# EAGLE design sensor_board_v0.8 (EAGLE 7.6.0)
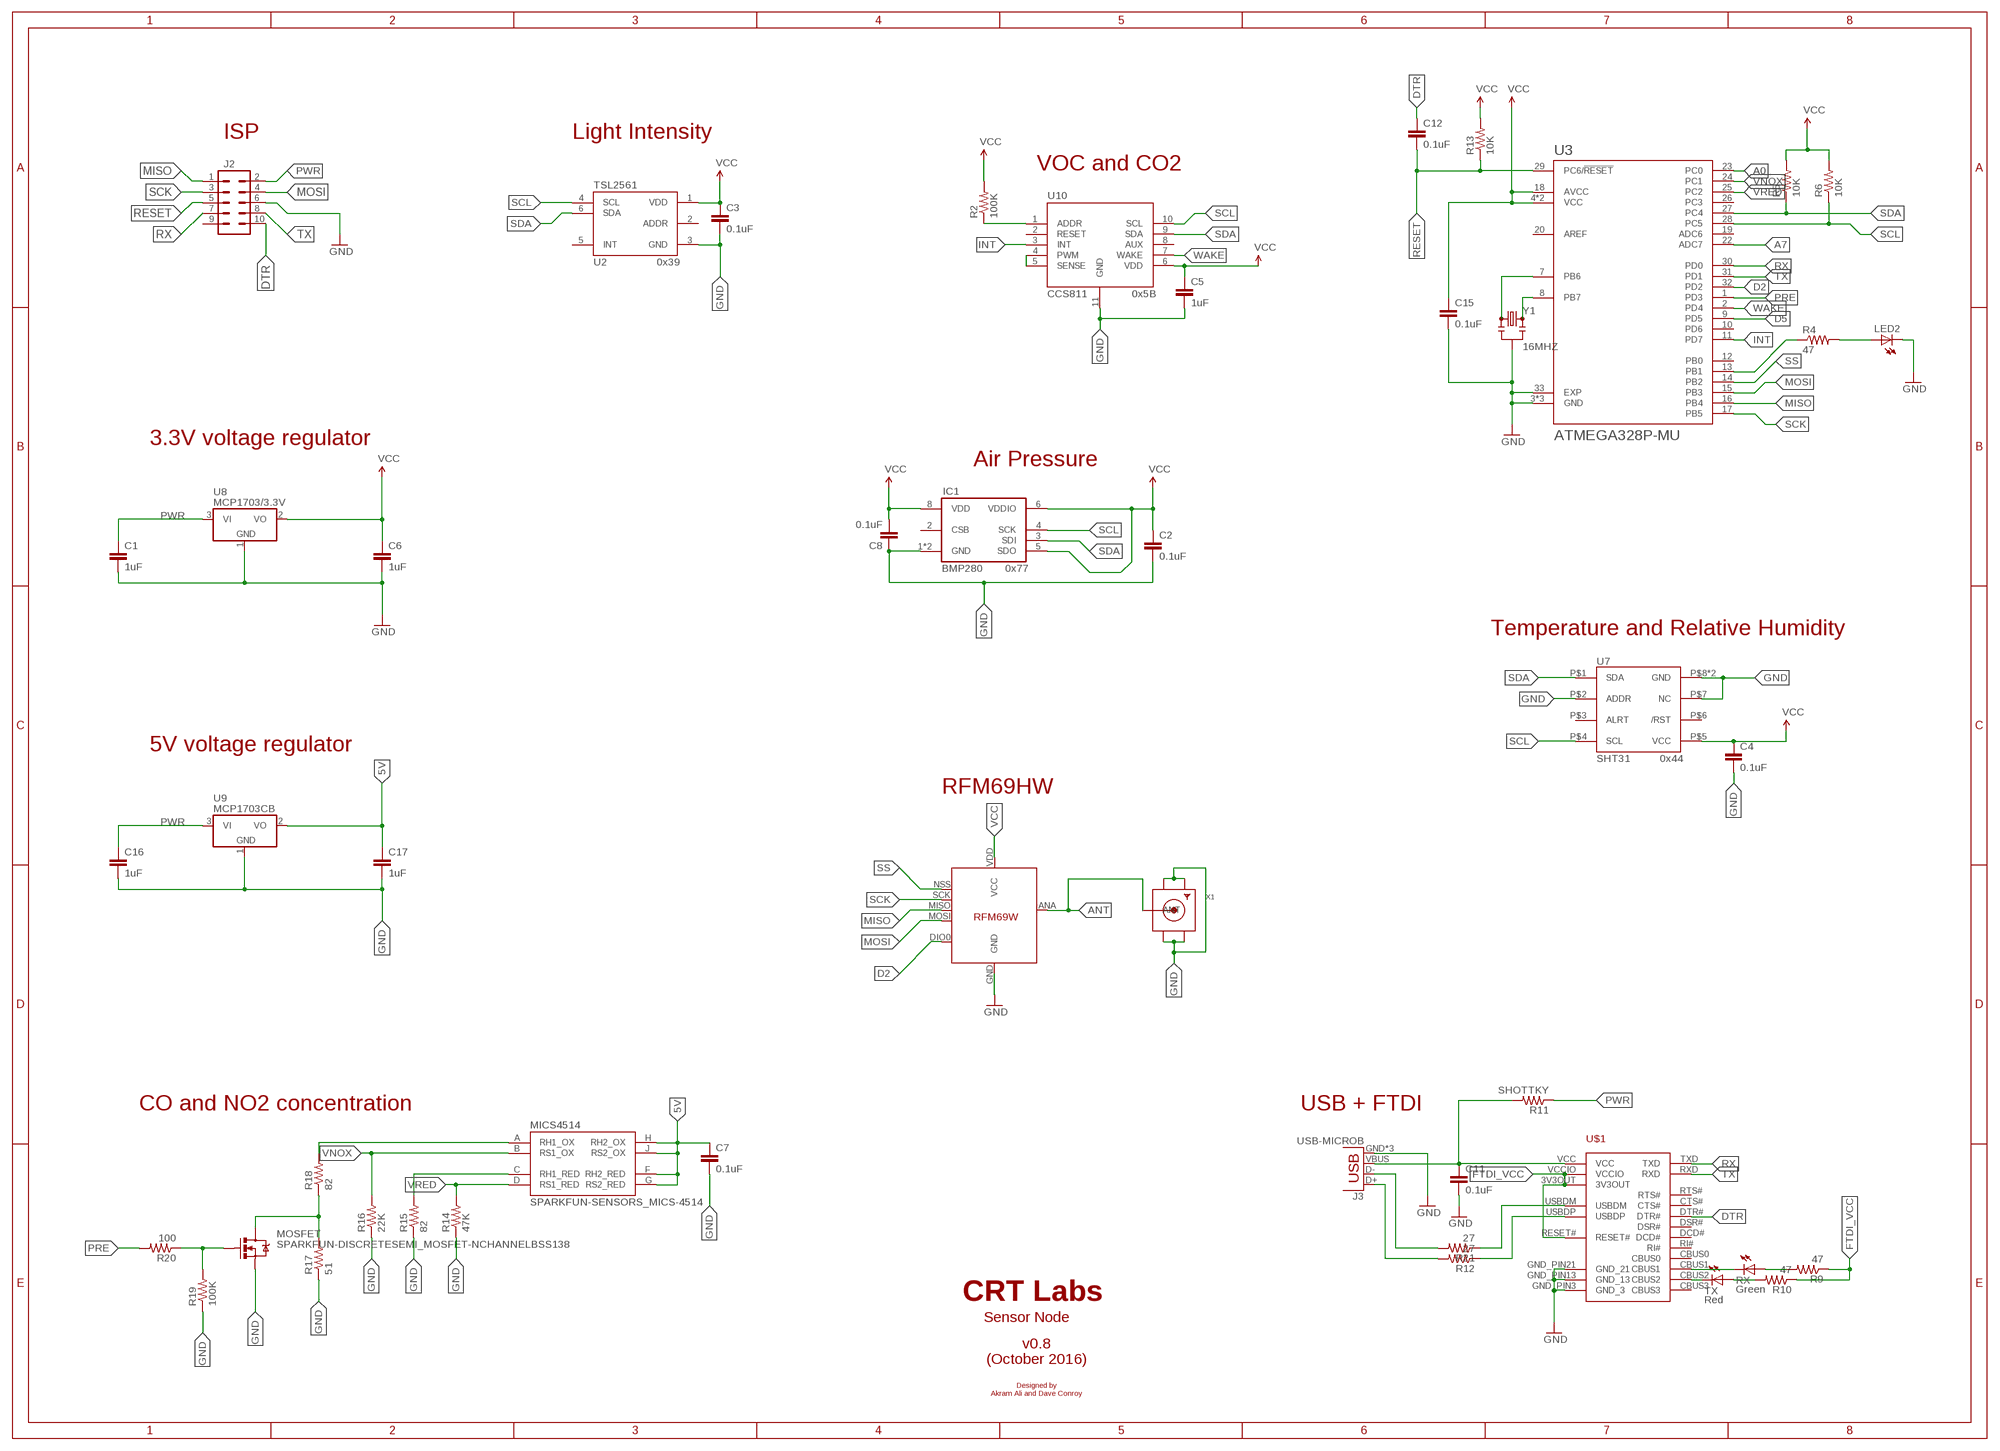
[diagram p0: schematic, sheet 1]

## Parts
C1  1uF  CAP0805  [0805]
C2  0.1uF  CAP0805  [0805]
C3  0.1uF  CAP0805  [0805]
C4  0.1uF  CAP0805  [0805]
C5  1uF  CAP0805  [0805]
C6  1uF  CAP0805  [0805]
C7  0.1uF  CAP0805  [0805]
C8  0.1uF  CAP0805  [0805]
C11  0.1uF  CAP0805  [0805]
C12  0.1uF  CAP0805  [0805]
C15  0.1uF  CAP0805  [0805]
C16  1uF  CAP0805  [0805]
C17  1uF  CAP0805  [0805]
IC1  BMP280  [BMP280]
J2  M05X2PTH  [AVR_ICSP]
J3  USB-MICROB  [USB-MICROB]
LED2  LEDCHIPLED_0805  [CHIPLED_0805]
MICS4514  SPARKFUN-SENSORS_MICS-4514  [SPARKFUN-SENSORS_MICS_10-SMD]
MOSFET  SPARKFUN-DISCRETESEMI_MOSFET-NCHANNELBSS138  [SPARKFUN-DISCRETESEMI_SOT23-3]
R2  100K  RESISTOR0805-RES  [0805]
R4  47  RESISTOR0805-RES  [0805]
R5  10K  RESISTOR0805-RES  [0805]
R6  10K  RESISTOR0805-RES  [0805]
R9  47  RESISTOR0805-RES  [0805]
R10  47  RESISTOR0805-RES  [0805]
R11  SHOTTKY  RESISTOR0805-RES  [0805]
R12  27  RESISTOR0805-RES  [0805]
R13  10K  RESISTOR0805-RES  [0805]
R14  47K  RESISTOR0805-RES  [0805]
R15  82  RESISTOR0805-RES  [0805]
R16  22K  RESISTOR0805-RES  [0805]
R17  51  RESISTOR0805-RES  [0805]
R18  82  RESISTOR0805-RES  [0805]
R19  100K  RESISTOR0805-RES  [0805]
R20  100  RESISTOR0805-RES  [0805]
R21  27  RESISTOR0805-RES  [0805]
RX  Green  LEDCHIPLED_0805  [CHIPLED_0805]
TX  Red  LEDCHIPLED_0805  [CHIPLED_0805]
U2  TSL2561  TSL2561FN  [FN-6]
U3  ATMEGA328P-MU  [QFN50P500X500X100-33N]
U7  SHT31  SHT31-DIS  [SHT3X]
U8  MCP1703/3.3V  MCP1703CB  [SOT23]
U9  MCP1703CB  [SOT23]
U10  CCS811  CCS811-I2C  [LGA]
U11  RFM69HW  LOWPOWERLAB_RFM69  [LOWPOWERLAB_RFM69W-MINPADS]
U$1  FT231XQ-R  [FTDI_FT231XQ-R_PACKAGE]
X1  SMACONNECTOR_EDGE  [SMA_EDGELAUNCH]
Y1  16MHZ  RESONATOR16MHZ  [RESONATOR-SMD]

## Nets
5V: C7.1 C17.1 MICS4514.F(RH2_RED) MICS4514.G(RS2_RED) MICS4514.H(RH2_OX) MICS4514.J(RS2_OX) U9.2(VO)
A0: U3.23(PC0)
A7: U3.22(ADC7)
ANT: U11.ANA(ANT) X1.P(ANT)
D2: U3.32(PD2) U11.DIO0
D5: U3.9(PD5)
DTR: C12.1 J2.10 U$1.DTR#
FTDI_VCC: R9.1 R10.1 U$1.3V3OUT U$1.RESET# U$1.VCCIO
GND: C1.2 C2.2 C3.2 C4.2 C5.2 C6.2 C7.2 C8.1 C11.2 C15.2 C16.2 C17.2 IC1.1(GND) IC1.7(GND) J2.6 J3.GND J3.MT1(GND) J3.MT2(GND) LED2.C MOSFET.2(S) R14.1 R15.1 R16.1 R17.1 R19.1 U2.3(GND) U3.3(GND) U3.5(GND) U3.21(GND) U3.33(EXP) U7.P$2(ADDR) U7.P$7(NC) U7.P$8(GND) U7.PAD(GND) U8.1(GND) U9.1(GND) U10.11(GND) U11.GND U$1.GND_PIN3(GND_3) U$1.GND_PIN13(GND_13) U$1.GND_PIN21(GND_21) X1.GND@1(GND4) X1.GND@2(GND3) X1.GND@3(GND2) X1.GND@4(GND1) Y1.2
INT: U3.11(PD7) U10.3(INT)
MISO: J2.1 U3.16(PB4) U11.MISO
MOSI: J2.4 U3.15(PB3) U11.MOSI
N$1: R2.1 U10.1(ADDR)
N$2: R4.1 U3.13(PB1)
N$3: LED2.A R4.2
N$4: U3.8(PB7) Y1.3
N$5: U3.7(PB6) Y1.1
N$6: U10.4(PWM) U10.5(SENSE)
N$8: MICS4514.A(RH1_OX) R18.2
N$13: MICS4514.C(RH1_RED) R15.2
N$17: RX.C U$1.CBUS1
N$18: TX.C U$1.CBUS2
N$20: MOSFET.3(D) R17.2 R18.1
N$23: MOSFET.1(G) R19.2 R20.1
N$25: R21.1 U$1.USBDM
N$26: R12.1 U$1.USBDP
N$27: R9.2 RX.A
N$29: R10.2 TX.A
N$32: J3.D- R21.2
N$33: J3.D+ R12.2
PRE: R20.2 U3.1(PD3)
PWR: C1.1 C16.1 J2.2 R11.1 U8.3(VI) U9.3(VI)
RESET: C12.2 J2.5 R13.1 U3.29(PC6/!RESET)
RX: J2.7 U3.30(PD0) U$1.TXD
SCK: J2.3 U3.17(PB5) U11.SCK
SCL: IC1.4(SCK) R6.1 U2.4(SCL) U3.28(PC5) U7.P$4(SCL) U10.10(SCL)
SDA: IC1.3(SDI) R5.1 U2.6(SDA) U3.27(PC4) U7.P$1(SDA) U10.9(SDA)
SS: U3.14(PB2) U11.NSS(SEL)
TX: J2.8 U3.31(PD1) U$1.RXD
VBUS: C11.1 J3.VBUS R11.2 U$1.VCC
VCC: C2.1 C3.1 C4.1 C5.1 C6.1 C8.2 C15.1 IC1.5(SDO) IC1.6(VDDIO) IC1.8(VDD) R2.2 R5.2 R6.2 R13.2 U2.1(VDD) U3.4(VCC) U3.6(VCC) U3.18(AVCC) U7.P$5(VCC) U8.2(VO) U10.6(VDD) U11.VDD(VCC)
VNOX: MICS4514.B(RS1_OX) R16.2 U3.24(PC1)
VRED: MICS4514.D(RS1_RED) R14.2 U3.25(PC2)
WAKE: U3.2(PD4) U10.7(WAKE)
Unconnected: IC1.2(CSB) J2.9 U2.2(ADDR) U2.5(INT) U3.10(PD6) U3.12(PB0) U3.19(ADC6) U3.20(AREF) U3.26(PC3) U7.P$3(ALRT) U7.P$6(/RST) U10.2(RESET) U10.8(AUX) U$1.CBUS0 U$1.CBUS3 U$1.CTS# U$1.DCD# U$1.DSR# U$1.RI# U$1.RTS#

## Notes on the sheet
- ISP | Light Intensity
- VOC and CO2
- 0x39
- 0x5B
- 3.3V voltage regulator
- Air Pressure
- 0x77
- Temperature and Relative Humidity
- 5V voltage regulator
- 0x44
- RFM69HW
- CO and NO2 concentration | USB + FTDI
- CRT Labs
- Sensor Node
- v0.8
  (October 2016)
- Designed by
  Akram Ali and Dave Conroy

## Library data of the parts
C1 C6 C11 C16 C17 = SparkFun-Capacitors:CAP: Capacitor Standard 0603 ceramic capacitor, and 0.1" leaded capacitor.; OC_NEWARK: unknown
C2 C8 C12 C15 = SparkFun-Passives:CAP: Capacitor Standard 0603 ceramic capacitor, and 0.1" leaded capacitor.
C3-C5 C7 = SparkFun-Passives:CAP: Capacitor Standard 0603 ceramic capacitor, and 0.1" leaded capacitor.; OC_NEWARK: unknown
IC1 = bosch-bmp280:BMP280: The BMP280 is an absolute barometric pressure sensor especially designed for mobile applications. The sensor module is housed in an extremely compact 8-pin metal-lid LGA package with a footprint of only 2.0 × 2.5 mm2 and 0.95 mm package height. Its small dimensions and its low power consumption of 2.7 μA @1Hz allow the implementation in battery driven devices such as mobile phones, GPS modules or watches. The library has been designed by Richard Magdycz <https://www.facebook.com/groups/eaglecadsoftUK>
J2 = SparkFun-Connectors:M05X2: Header 5x2 Standard 10-pin dual row 0.1" header. Commonly used with AVR-ISP. Use with Spark Fun Electronics SKU: PRT-00778
J3 = SparkFun-Connectors:USB: USB Connectors USB-B-PTH is fully proven SKU : PRT-00139/CONN-08278 USB-miniB is fully proven SKU : PRT-00587 USB-A-PCB is untested. USB-A-H is throughly reviewed, but untested. Spark Fun Electronics SKU : PRT-00437 USB-B-SMT is throughly reviewed, but untested. Needs silkscreen touching up. USB-A-S has not been used/tested USB-MB-H has not been used/tested USB-MICROB has been used. CONN-09505; PROD_ID: CONN-09505
LED2 RX TX = adafruit:LED: LED OSRAM: - CHIPLED LG R971, LG N971, LY N971, LG Q971, LY Q971, LO R971, LY R971 LH N974, LH R974 LS Q976, LO Q976, LY Q976 LO Q996 - Hyper CHIPLED LW Q18S LB Q993, LB Q99A, LB R99A - SideLED LS A670, LO A670, LY A670, LG A670, LP A670 LB A673, LV A673, LT A673, LW A673 LH A674 LY A675 LS A676, LA A676, LO A676, LY A676, LW A676 LS A679, LY A679, LG A679 - Hyper Micro SIDELED® LS Y876, LA Y876, LO Y876, LY Y876 LT Y87S - SmartLED LW L88C, LW L88S LB L89C, LB L89S, LG L890 LS L89K, LO L89K, LY L89K LS L896, LA L896, LO L896, LY L896 - TOPLED LS T670, LO T670, LY T670, LG T670, LP T670 LSG T670, LSP T670, LSY T670, LOP T670, LYG T670 LG T671, LOG T671, LSG T671 LB T673, LV T673, LT T673, LW T673 LH T674 LS T676, LA T676, LO T676, LY T676, LB T676, LH T676, LSB T676, LW T676 LB T67C, LV T67C, LT T67C, LS T67K, LO T67K, LY T67K, LW E67C LS E67B, LA E67B, LO E67B, LY E67B, LB E67C, LV E67C, LT E67C LW T67C LS T679, LY T679, LG T679 LS T770, LO T770, LY T770, LG T770, LP T770 LB T773, LV T773, LT T773, LW T773 LH T774 LS E675, LA E675, LY E675, LS T675 LS T776, LA T776, LO T776, LY T776, LB T776 LHGB T686 LT T68C, LB T68C - Hyper Mini TOPLED® LB M676 - Mini TOPLED Santana® LG M470 LS M47K, LO M47K, LY M47K Source: http://www.osram.convergy.de/; OC_NEWARK: unknown
MICS4514 = MICS-4514_CO_and_NOx_Sensor_Breakout:SPARKFUN-SENSORS_MICS-4514: Metal oxide MEMS carbon monoxide (CO) and NOx sensor in an SMD package.; PROD_ID: COMP-12310
MOSFET = MICS-4514_CO_and_NOx_Sensor_Breakout:SPARKFUN-DISCRETESEMI_MOSFET-NCHANNEL: Common NMOSFET Parts MFG P/N Store ID Prod ID FDD8780 TRANS-09984 SI7820DN TRANS-11055 FDS6630A IC-08089 2N7002PW TRANS-11151 FQP30N06L COM-10213 TRANS-10060 BSS123LT1G TRANS-08345 BSS138 TRANS-00830 BS170 2N7000; PROD_ID: TRANS-00830
R2 R9-R12 R14-R21 = SparkFun-Passives:RESISTOR: Resistor Basic schematic elements and footprints for 0603, 1206, and PTH resistors.; OC_NEWARK: unknown
R4-R6 = SparkFun-Resistors:RESISTOR: Resistor Basic schematic elements and footprints for 0603, 1206, and PTH resistors.; OC_NEWARK: unknown
R13 = SparkFun-Passives:RESISTOR: Resistor Basic schematic elements and footprints for 0603, 1206, and PTH resistors.
U2 = SparkFun-DigitalIC:TSL2561: TSL2561 illumination sensor Approximates Human Eye Response Precisely Measures Illuminance Programmable Interrupt Function with User-Defined Upper and Lower Threshold 400 KHz I2C interface Programmable Analog Gain and Integration Time Supporting 1,000,000-to-1 Dynamic Range Automatically Rejects 50/60-Hz Lighting Ripple Low Active Power (0.75 mW Typical) with Power Down Mode RoHS Compliant The TSL2561 is a light-to-digital converter that transform light intensity to a digital signal output via I2C interface. The device combines one broadband photodiode (visible plus infrared) and one infrared-responding photodiode on a single CMOS integrated circuit capable of providing a near-photopic response over an effective 20-bit dynamic range (16-bit resolution). Two integrating ADCs convert the photodiode currents to a digital output that represents the irradiance measured on each channel. This digital output can be input to a microprocessor where illuminance (ambient light level) in lux is derived using an empirical formula to approximate the human eye response. The TSL2561 device supports a traditional level style interrupt that remains asserted until the firmware clears it.; DIGIKEY#: TSL2561-FNCT-ND; MANF: AMS-TAOS-USA-Inc.; MANF#: TSL2561FN; MOUSER#: 856-TSL2561T; MPN: TSL2561FN; OC_NEWARK: 82Y5564; PROD_ID: IC-11791
U3 = ATMEGA328P-MU:ATMEGA328P-MU: ATmega Series 20 MHz 32 KB Flash 2 KB SRAM 8-Bit Microcontroller - QFN-32; AVAILABILITY: Good; DESCRIPTION: ATmega Series 20 MHz 32 KB Flash 2 KB SRAM 8-Bit Microcontroller - QFN-32; MF: Atmel; MP: ATMEGA328P-MU; PACKAGE: QFN-32 Atmel; PRICE: 2.55 USD
U7 = thomasb9511:SHT31-DIS; MPN: SHT31-DIS-B; OC_NEWARK: 47Y1304
U8 U9 = linear:MCP1703: 250 mA, 16V, Low Quiescent Current LDO Regulator Source: http://ww1.microchip.com/downloads/en/DeviceDoc/22049b.pdf; MPN: MCP1703T-2502E/CB; OC_NEWARK: 18T9177
U10 = CCS811:CCS811
U11 = RFM69 USB Gateway:LOWPOWERLAB_RFM69
U$1 = ftdi_ft231xq-r:FT231XQ-R: This is the 20-LD QFN package of the FTDI FT231XQ-R chip.
X1 = adafruit:SMACONNECTOR: SMA Connector 90° DIP SMA Connector, 50 Ohm (4UConnector: 07259)
Y1 = SparkFun-FreqCtrl:RESONATOR: Resonator Small SMD resonator. Used, eg, on the Arduino Pro/ Pro Mini boards. 8MHz- XTAL-08895 16MHz- XTAL-08900; OC_NEWARK: unknown; PROD_ID: XTAL-08900

## Board
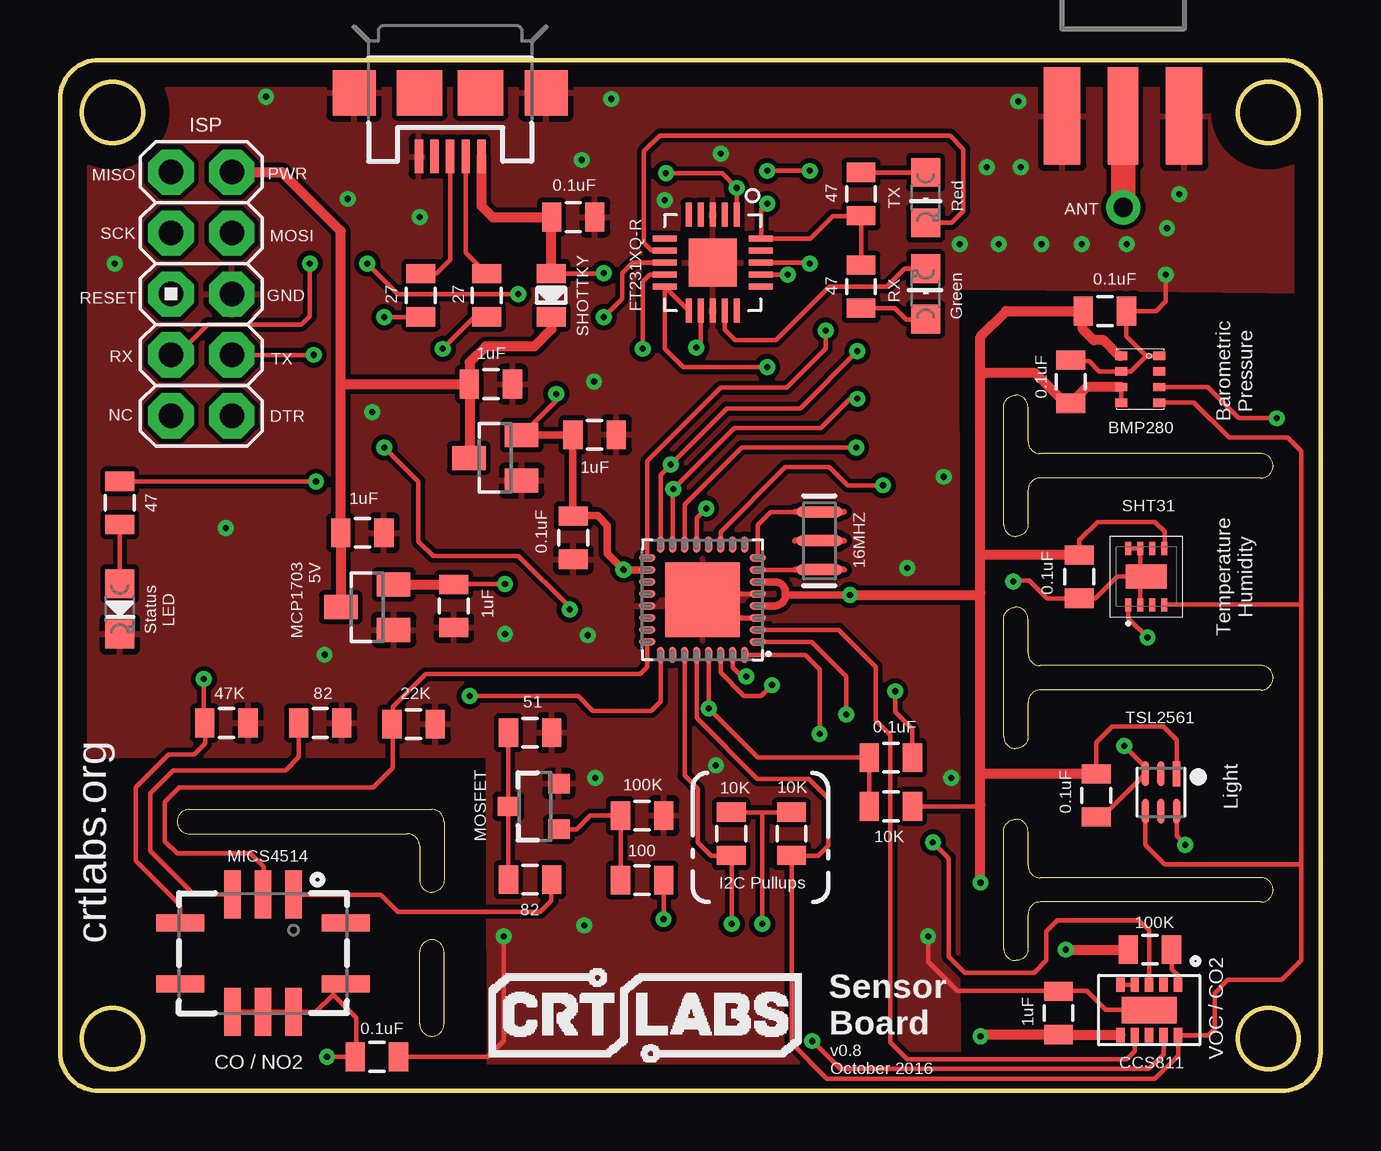
[diagram p1: board, top side]
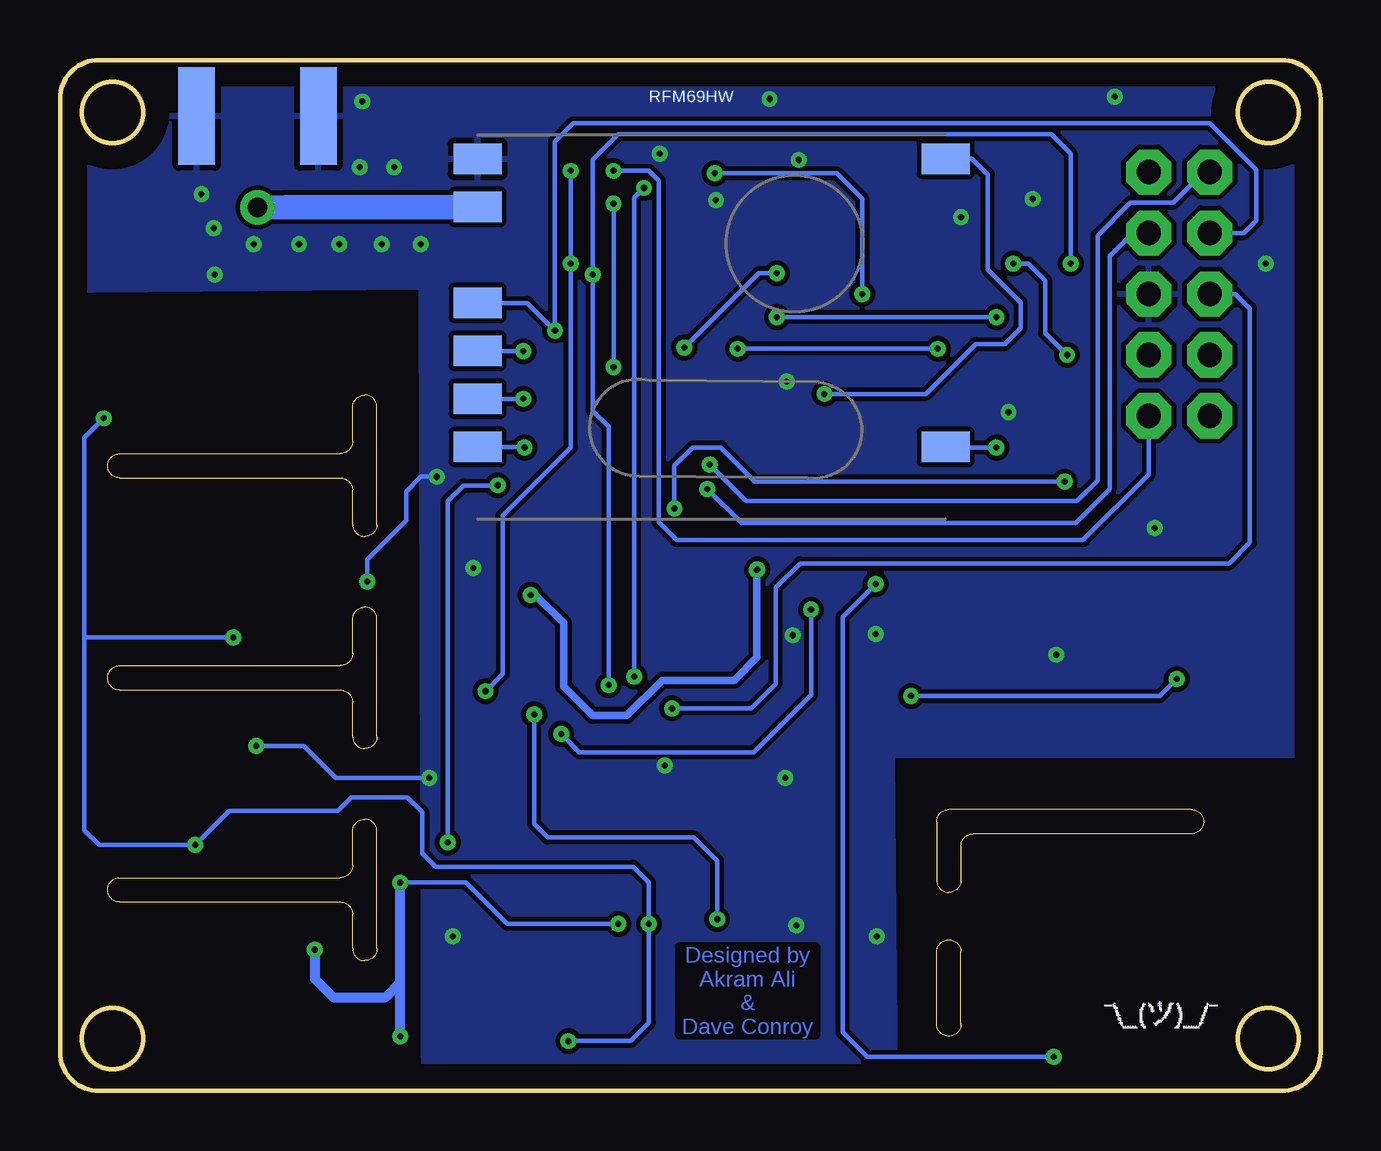
[diagram p2: board, bottom side, seen from below]

Size 52.53 x 42.98 mm. Coordinates in mm from the lower left corner, seen from the top.
Outline: 0,41.35 arc-90 1.63,42.98 50.95,42.98
Outline: 0,1.63 arc90 1.63,0 50.95,0
Outline: 0,41.4 0,1.52
Outline: 50.9,0 arc90 52.53,1.63
Outline: 50.9,42.98 arc-90 52.53,41.35 52.53,1.52
Outline: 50.04,8.89 40.84,8.89 arc-90 40.34,9.4 40.34,10.82 arc90 39.83,11.33 arc90 39.32,10.82 39.32,5.94 arc90 39.83,5.44 arc90 40.34,5.94 40.34,7.37 arc-90 40.84,7.87 50.04,7.87 arc90 50.55,8.38 arc90 50.04,8.89
Outline: 50.04,17.73 40.84,17.73 arc-90 40.34,18.24 40.34,19.66 arc90 39.83,20.17 arc90 39.32,19.66 39.32,14.78 arc90 39.83,14.27 arc90 40.34,14.78 40.34,16.21 arc-90 40.84,16.71 50.04,16.71 arc90 50.55,17.22 arc90 50.04,17.73
Outline: 50.04,26.57 40.84,26.57 arc-90 40.34,27.08 40.34,28.5 arc90 39.83,29.01 arc90 39.32,28.5 39.32,23.62 arc90 39.83,23.11 arc90 40.34,23.62 40.34,25.04 arc-90 40.84,25.55 50.04,25.55 arc90 50.55,26.06 arc90 50.04,26.57
Outline: 5.38,10.72 14.48,10.72 arc-90 14.99,10.21 14.99,8.79 arc90 15.49,8.28 arc90 16,8.79 16,11.23 arc90 15.49,11.73 5.38,11.73 arc90 4.88,11.23 arc90 5.38,10.72
Outline: 16,2.79 16,5.79 arc90 15.49,6.3 arc90 14.99,5.79 14.99,2.79 arc90 15.49,2.29 arc90 16,2.79
Outline: circle at 2.18,40.79 radius 1.27
Outline: circle at 2.18,2.18 radius 1.27
Outline: circle at 50.34,2.18 radius 1.27
Outline: circle at 50.34,40.79 radius 1.27
Copper layers (1*16): Top 0.035mm / dielectric 1.5mm / Bottom 0.035mm
Design rules "default": minimum track width 10mil, minimum drill 24mil, track to track 8mil, track to pad 8mil, pad to pad 8mil, via to via 8mil, smd to smd 8mil, copper to edge 40mil, drill to drill 8mil, minimum pad ring 10mil, minimum via ring 8mil, stop-mask expansion 4mil, vias tented up to drill 0mil, thermal gap 10mil

### Footprints (pad centres in the part's own frame; a part is rotated, then mirrored left to right if it is on the bottom)
0805 = smd 0.8 x 1.2: 1 -0.9,0; 2 0.9,0
BMP280 = smd 0.35 x 0.5: 1 0.975,-0.8; 2 0.325,-0.8; 3 -0.325,-0.8; 4 -0.975,-0.8; 5 -0.975,0.8; 6 -0.325,0.8; 7 0.325,0.8; 8 0.975,0.8
AVR_ICSP = drill 1.016 pad 1.88 octagon: 1 -1.27,5.08; 2 1.27,5.08; 3 -1.27,2.54; 4 1.27,2.54; 5 -1.27,0; 6 1.27,0; 7 -1.27,-2.54; 8 1.27,-2.54; 9 -1.27,-5.08; 10 1.27,-5.08
USB-MICROB = smd 0.35 x 1.4: D+ 0,2.65; D- -0.65,2.65; GND 1.3,2.65; ID 0.65,2.65; VBUS -1.3,2.65 | smd 1.8 x 1.9: MT1 -4,0; MT2 4,0 | smd 1.9 x 1.9: P$1 -1.27,0; P$2 1.27,0
CHIPLED_0805 = smd 1.2 x 1.2: A 0,-1.05; C 0,1.05
SPARKFUN-SENSORS_MICS_10-SMD = smd 0.7 x 2: A 1.27,2.45; B 0,2.45; C -1.27,2.45; F -1.27,-2.45; G 0,-2.45; H 1.27,-2.45 | smd 2 x 0.7: D -3.45,1.27; E -3.45,-1.27; J 3.45,-1.27; K 3.45,1.27
SPARKFUN-DISCRETESEMI_SOT23-3 = smd 0.8 x 0.9: 1 -0.95,-1; 2 0.95,-1; 3 0,1.1
FN-6 = smd 1.05 x 0.3: 1 -0.775,0.65; 2 -0.775,0; 3 -0.775,-0.65; 4 0.775,-0.65; 5 0.775,0; 6 0.775,0.65
QFN50P500X500X100-33N = smd 0.7 x 0.3: 1 -2.3,1.75; 2 -2.3,1.25; 3 -2.3,0.75; 4 -2.3,0.25; 5 -2.3,-0.25; 6 -2.3,-0.75; 7 -2.3,-1.25; 8 -2.3,-1.75; 17 2.3,-1.75; 18 2.3,-1.25; 19 2.3,-0.75; 20 2.3,-0.25; 21 2.3,0.25; 22 2.3,0.75; 23 2.3,1.25; 24 2.3,1.75 | smd 0.3 x 0.7: 9 -1.75,-2.3; 10 -1.25,-2.3; 11 -0.75,-2.3; 12 -0.25,-2.3; 13 0.25,-2.3; 14 0.75,-2.3; 15 1.25,-2.3; 16 1.75,-2.3; 25 1.75,2.3; 26 1.25,2.3; 27 0.75,2.3; 28 0.25,2.3; 29 -0.25,2.3; 30 -0.75,2.3; 31 -1.25,2.3; 32 -1.75,2.3 | smd 3.1 x 3.1: 33 0,0
SHT3X = smd 0.55 x 0.25: P$1 -1.175,0.75; P$2 -1.175,0.25; P$3 -1.175,-0.25; P$4 -1.175,-0.75; P$5 1.175,-0.75; P$6 1.175,-0.25; P$7 1.175,0.25; P$8 1.175,0.75 | smd 1 x 1.7: PAD 0,0
SOT23 = smd 1 x 1.4: 1 -0.95,-1.1; 2 0.95,-1.1; 3 0,1.1
LGA = smd 0.6 x 0.35: 1 0.3,3.2; 2 0.3,2.6; 3 0.3,2; 4 0.3,1.4; 5 0.3,0.8; 6 2.4,0.8; 7 2.4,1.4; 8 2.4,2; 9 2.4,2.6; 10 2.4,3.2 | smd 1.1 x 2.3: 11 1.35,2
LOWPOWERLAB_RFM69W-MINPADS = smd 2 x 1.27: ANA 8,-5; DIO0 -11.5,5; GND 8,-7; MISO 8,1; MOSI 8,3; NSS 8,5; SCK 8,-1; VDD -11.5,-7
FTDI_FT231XQ-R_PACKAGE = smd 0.25 x 1: 3V3OUT 0.968,-2.032; CBUS2 -0.532,-2.032; CBUS3 0.968,1.968; CTS# -1.032,-2.032; DTR# -0.032,1.968; RTS# -0.532,1.968; TXD 0.468,1.968; USBDM 0.468,-2.032; USBDP -0.032,-2.032; VCCIO -1.032,1.968 | smd 1 x 0.25: CBUS0 1.968,0.968; CBUS1 1.968,0.468; DCD# -2.032,-1.032; DSR# -2.032,-0.532; GND_PIN3 -2.032,-0.032; GND_PIN13 1.968,-0.032; RESET# 1.968,-1.032; RI# -2.032,0.468; RXD -2.032,0.968; VCC 1.968,-0.532 | smd 2 x 2: GND_PIN21 -0.032,-0.032
SMA_EDGELAUNCH = smd 4.064 x 1.524: GND@1 2.032,-2.54; GND@2 2.032,2.54 | smd 4.064 x 1.524 bottom: GND@3 2.032,2.54; GND@4 2.032,-2.54 | smd 4.064 x 1.27: P 2.032,0
RESONATOR-SMD = smd 0.45 x 1.905: 1 -1.2,0; 2 0,0; 3 1.2,0

### Placement (x,y rotation side)
C1  17.96,29.46 0 top
C2  42.11,29.57 90 top
C3  43.18,12.32 270 top
C4  42.47,21.44 270 top
C5  41.61,3.25 90 top
C6  22.28,27.36 0 top
C7  13.21,1.42 0 top
C8  43.54,32.51 180 top
C11  21.39,36.42 0 top
C12  34.62,13.89 180 top
C15  21.39,23.06 270 top
C16  12.6,23.27 0 top
C17  16.41,20.22 270 top
IC1  45.01,29.67 90 top
J2  5.89,33.22 0 top
J3  16.26,41.61 180 top
LED2  2.49,20.09 180 top
MICS4514  8.46,5.74 0 top
MOSFET  19.79,11.86 90 top
R2  45.42,5.89 180 top
R4  2.49,24.51 270 top
R5  27.97,10.72 90 top
R6  30.48,10.72 90 top
R9  33.38,33.53 270 top
R10  33.38,37.39 90 top
R11  20.47,33.17 90 top
R12  15.04,33.17 90 top
R13  34.62,11.86 0 top
R14  6.93,15.34 180 top
R15  10.85,15.34 180 top
R16  14.73,15.29 180 top
R17  19.58,14.94 180 top
R18  19.58,8.81 0 top
R19  24.26,11.48 180 top
R20  24.26,8.79 0 top
R21  17.78,33.17 90 top
RX  36.07,33.22 0 top
TX  36.07,37.24 180 top
U2  45.87,12.45 270 top
U3  26.77,20.47 180 top
U7  45.26,21.44 90 top
U8  18.14,26.39 90 top
U9  12.8,20.17 90 top
U10  43.38,4.72 270 top
U11  27.13,31.85 180 bottom
U$1  27.23,34.49 270 top
X1  44.3,42.67 270 top
Y1  31.65,22.94 90 top

### Tracks (layer width: path | path; a pad name or v marks a point on that pad's centre or on a via)
5V  (via drill 0.25 pad 0.13)
  Top 0.178: MICS4514.J 11.38,4.25 11.38,4.01 | v18.54,21.13 16.42,21.13 C17.1 | MICS4514.F MICS4514.G MICS4514.H 10.66,3.29 11.38,4.01 | v11.13,1.42 C7.1 12.34,1.46 12.34,3.05 11.38,4.01
  Top 0.406: U9.2 C17.1
  Bottom 0.178: v18.54,21.13 19.91,19.76 19.91,2.44 18.9,1.42 v11.13,1.42
ANT  (via drill 0.8 pad 1.42)
  Top 1.016: X1.P v44.3,36.83
  Bottom 1.016: U11.ANA 43.11,36.85 v44.3,36.83
D2  (via drill 0.25 pad 0.13)
  Top 0.178: v21.23,20.07 21.23,20.17 19.1,22.3 15.54,22.3 14.94,22.91 14.94,25.4 v13.51,26.82 | U3.32 31.05,18.17 31.65,17.58 v31.65,14.88
  Bottom 0.178: v21.23,20.07 21.23,16.51 23.62,14.12 30.89,14.12 v31.65,14.88 | 15.65,26.83 U11.DIO0 15.6,26.82 v13.51,26.82
DTR  (via drill 0.25 pad 0.13)
  Top 0.178: v34.8,16.66 34.8,15.8 35.51,15.09 C12.1 | U$1.DTR# 31.21,34.53 v31.24,34.49 | v31.24,38.35 v29.46,38.35
  Bottom 0.178: v34.8,16.66 34.09,17.37 34.09,23.98 31.24,26.82 v31.24,34.49 v31.24,38.35 | J2.10 7.16,25.7 9.91,22.96 26.82,22.96 27.58,23.72 27.58,37.95 27.99,38.35 v29.46,38.35
FTDI_VCC  (via drill 0.25 pad 0.13)
  Top 0.178: R9.1 R10.1 33.36,36.47 32.21,36.47 31.26,35.53 U$1.VCCIO 29.21,35.54 29.21,36.78 29.41,36.98 v29.46,36.98 | v29.46,30.18 25.96,30.18 25.2,30.94 U$1.3V3OUT U$1.RESET#
  Bottom 0.178: v29.46,30.18 v29.46,36.98
GND  (via drill 0.25 pad 0.13)
  Top 0.178: U10.11 43.56,3.37 42.77,4.17 41.62,4.17 | 41.62,4.17 C5.2 | 41.62,4.17 37.39,4.17 36.17,5.38 v36.17,6.45 | U7.P$2 45.01,21.19 U7.PAD | U7.P$8 U7.P$7 45.01,21.69 U7.PAD | U7.PAD 44.04,21.44 43.14,20.54 C4.2 41.13,20.54 40.39,21.29 39.78,21.29 v39.73,21.23 | C3.2 43.42,11.42 U2.3 45.22,13.5 v44.35,14.38 | C7.2 17.83,1.42 18.49,2.08 v18.49,6.45 | 46.11,34 v46.08,34.04 46.08,32.92 45.67,32.51 C8.1 44.44,31.46 45.26,30.63 | C2.2 42.15,30.43 42.88,30.43 43.31,29.99 IC1.7 44.62,29.99 45.26,30.63 | 45.26,30.63 45.8,30.63 IC1.1 | U3.5 27.02,20.72 U3.33 27.52,19.72 U3.3
  Bottom 0.178: v39.73,21.23 39.73,22.15 38.1,23.77 38.1,24.99 37.49,25.6 v36.83,25.6 | v44.35,14.38 42.37,14.38 41.05,13.06 v37.13,13.06
  other vias: 40.03,38.51 27.53,39.07 11.02,18.19 11.99,37.19 13,28.3 22,19 22.25,29.57 6.91,23.47 22.3,13.06 38.61,38.51 46.63,37.39 46.13,35.97 44.45,35.31 42.57,35.31 40.89,35.31 39.12,35.31 37.49,35.31 21.74,38.81 2.29,34.49 18.54,19.05 27.33,13.56 35.31,21.79 21.84,6.91 22.96,41.35 39.93,41.25 8.59,41.45 25.2,37.13 14.99,36.42
  pour Top: -1.17,45.57 55.63,45.36 55.78,33.27 37.39,33.48 37.44,-2.29 17.88,-2.29 17.83,13.97 -1.42,13.97 -1.42,40.89
  pour Bottom: -1.32,45.57 55.58,45.42 55.73,33.32 37.49,33.48 37.39,-2.18 17.68,-2.18 17.83,13.97 -1.47,13.97 -1.47,41
INT  (via drill 0.25 pad 0.13)
  Top 0.178: U10.3 45.38,6.69 44.96,7.11 41.55,7.11 41.1,6.65 41.1,5.44 40.59,4.93 37.69,4.93 37.03,5.59 37.03,9.7 v36.37,10.36 | v34.29,25.25 32.82,25.25 32.05,26.01 30.23,26.01 27.52,23.31 U3.11
  Bottom 0.178: v36.37,10.36 36.37,24.59 35.71,25.25 v34.29,25.25
MISO  (via drill 0.25 pad 0.13)
  Top 0.178: v33.22,30.84 30.84,28.45 27.79,28.45 v25.45,26.11 25.02,25.68 U3.16
  Bottom 0.178: U11.MISO 33.24,30.85 v33.22,30.84 | J2.1 4.88,38.3 6.15,37.03 7.92,37.03 9.3,35.66 9.3,25.45 10.16,24.59 23.93,24.59 v25.45,26.11
MOSI  (via drill 0.25 pad 0.13)
  Top 0.178: v33.22,28.85 32.92,28.85 31.7,27.64 28.09,27.64 v25.55,25.1 25.52,25.06 U3.15
  Bottom 0.178: U11.MOSI v33.23,28.85 v33.22,28.85 | J2.4 7.82,35.76 8.79,34.8 8.79,25.1 10.21,23.67 24.13,23.67 v25.55,25.1
N$1
  Top 0.178: U10.1 | 46.33,6.13 R2.1 46.33,5.88 46.33,5.08 46.58,4.83 U10.1
N$2  (via drill 0.25 pad 0.13)
  Top 0.178: R4.1 10.66,25.41 v10.67,25.4 | U3.13 26.52,23.88 v26.92,24.28
  Bottom 0.178: v10.67,25.4 23.57,25.4 24.99,26.82 26.16,26.82 26.92,26.06 v26.92,24.28
N$3
  Top 0.178: R4.2 LED2.A
N$4
  Top 0.178: U3.8 29.07,23.59 29.62,24.13 30.63,24.13 30.63,24.14
N$5
  Top 0.178: U3.7 30.62,21.72 30.63,21.74
N$6
  Top 0.178: U10.5 U10.4
N$8
  Top 0.178: R18.2 20.47,8.8 20.47,7.92 20.02,7.47 14.07,7.47 13.36,8.18 9.74,8.18 MICS4514.A
N$13
  Top 0.178: R15.2 9.96,15.33 9.96,13.92 9.4,13.36 4.72,13.36 3.76,12.4 3.76,10.01 5.58,8.19 MICS4514.C
N$17
  Top 0.178: RX.C 35.19,34.27 34.44,33.53 32.05,33.53 29.82,31.29 28.14,31.29 27.7,31.74 U$1.CBUS1
N$18
  Top 0.178: TX.C 37.15,36.19 37.64,36.68 37.64,39.27 37.08,39.83 24.99,39.83 24.33,39.17 24.33,35.36 24.66,35.03 U$1.CBUS2
N$20
  Top 0.178: R18.1 MOSFET.3 R17.2
N$23
  Top 0.178: MOSFET.1 21.53,10.91 22.1,11.48 R19.2 R20.1
N$25  (via drill 0.25 pad 0.13)
  Top 0.178: R21.1 17.29,32.27 v15.95,30.94 | U$1.USBDM 24.58,34.03 24.28,33.73 v24.28,30.94
  Bottom 0.178: v15.95,30.94 v24.28,30.94
N$26  (via drill 0.25 pad 0.13)
  Top 0.178: v13.51,32.26 15.02,32.26 R12.1 | U$1.USBDP 23.86,34.53 23.42,34.09 23.42,33.02 v22.66,32.26
  Bottom 0.178: v13.51,32.26 v22.66,32.26
N$27
  Top 0.178: R9.2 34.78,32.63 35.26,32.16 36.05,32.16 RX.A
N$29
  Top 0.178: TX.A R10.2
N$32
  Top 0.178: J3.D- 16.91,34.95 R21.2
N$33
  Top 0.178: R12.2 15.68,34.07 16.26,34.65 J3.D+
PRE  (via drill 0.25 pad 0.13)
  Top 0.178: R20.2 v25.16,7.17 v25.15,7.16 | U3.1 31.32,18.72 32.77,17.27 v32.77,15.7
  Bottom 0.178: v25.15,7.16 25.15,9.6 26.11,10.57 32.21,10.57 32.77,11.13 v32.77,15.7
PWR
  Top 0.406: R11.1 20.47,31.75 19.76,31.04 17.73,31.04 17.07,30.38 17.07,29.48 | 17.07,29.48 C1.1 11.7,29.46 | 17.07,29.48 17.07,26.42 U8.3 | U9.3 C16.1 11.7,29.46 | J2.2 9.25,38.3 11.7,35.85 11.7,29.46
RESET  (via drill 0.25 pad 0.13)
  Top 0.178: R13.1 C12.2 29.08,13.89 v27.03,15.95 v27.02,15.96 U3.29
  Bottom 0.178: J2.5 3.56,33.22 2.95,32.61 2.95,22.86 3.81,22 21.69,22 22.71,20.98 22.71,16.97 23.72,15.95 v27.03,15.95
RX  (via drill 0.25 pad 0.13)
  Top 0.178: J2.7 4.88,30.68 6.15,31.95 10.06,31.95 10.41,32.31 v10.41,34.49 | U3.30 27.52,17.44 28.5,16.46 29.21,16.46 v29.67,16.92 | U$1.TXD v30.32,34.03 v30.33,34.04
  Bottom 0.178: v10.41,34.49 10.41,39.07 11.23,39.88 29.26,39.88 30.33,38.81 v30.33,34.04 30.33,28.35 29.67,27.69 v29.67,16.92
SCK  (via drill 0.25 pad 0.13)
  Top 0.178: v31.9,31.7 31.9,30.94 30.28,29.31 27.53,29.31 24.47,26.25 U3.17
  Bottom 0.178: U11.SCK 33.05,32.85 v31.9,31.7 31.9,39.57 31.14,40.34 4.62,40.34 2.69,38.4 2.69,36.27 3.2,35.76 J2.3
SCL
  Top 0.178: U2.4 45.21,11.66 45.21,10.26 46.02,9.45 51.71,9.45 | U10.10 47.84,2.32 48.11,2.59 48.11,4.06 48.67,4.62 50.9,4.62 51.71,5.44 51.71,9.45 | 51.71,9.45 51.71,20.27 | U7.P$4 51.71,20.27 | 51.71,20.27 51.71,26.67 51.16,27.23 48.72,27.23 47.24,28.7 45.82,28.7 IC1.4 | U10.10 46.58,1.47 45.62,0.51 31.95,0.51 30.48,1.98 R6.1 30.49,9.8 31.6,9.8 32,10.21 32,12.19 31.19,13 29.06,13 26.52,15.54 U3.28 | U10.10
SDA  (via drill 0.25 pad 0.13)
  Top 0.178: v31.34,2.08 32.51,0.91 45.36,0.91 45.98,1.53 U10.9 | U7.P$1 44.51,19.7 v45.31,18.9 | U2.6 46.52,10.63 v46.89,10.26 | v27.99,6.96 27.99,9.79 R5.1 27.95,9.8 27.13,9.8 26.57,10.36 26.57,12.6 26.02,13.15 U3.27 | IC1.3 47.82,29.34 49.12,28.04 v50.7,28.04
  Bottom 0.178: v31.34,2.08 28.75,2.08 27.99,2.84 v27.99,6.96 27.99,8.69 28.65,9.35 36.88,9.35 37.44,9.91 37.44,11.63 38.05,12.24 40.39,12.24 40.94,11.68 45.47,11.68 v46.89,10.26 50.9,10.26 51.51,10.87 51.51,18.95 | v45.31,18.9 51.46,18.9 51.51,18.95 | 51.51,18.95 51.51,27.23 v50.7,28.04
SS  (via drill 0.25 pad 0.13)
  Top 0.178: v33.17,26.82 28.4,26.82 26.02,24.45 U3.14
  Bottom 0.178: U11.NSS 33.2,26.85 v33.17,26.82
TX  (via drill 0.25 pad 0.13)
  Top 0.178: v10.57,30.68 J2.8 | v12.8,34.49 14.07,33.22 v19.1,33.22 | U3.31 28.02,17.65 28.4,17.27 v28.6,17.27 | U$1.RXD v28.2,37.64 v28.19,37.64 27.58,38.25 v25.25,38.25
  Bottom 0.178: v12.8,34.49 12.19,34.49 11.48,33.78 11.48,31.6 v10.57,30.68 | v28.6,17.27 28.6,37.24 v28.19,37.64 | v25.25,38.25 20.17,38.25 19.1,37.19 v19.1,33.22
VBUS  (via drill 0.25 pad 0.13)
  Top 0.178: R11.2 22.64,34.07 v22.66,34.09 | U$1.VCC 26.7,31.17 v26.52,30.99
  Top 0.406: J3.VBUS 17.56,36.9 18.03,36.42 C11.1 20.47,36.41 R11.2
  Bottom 0.178: v22.66,34.09 23.42,34.09 v26.52,30.99
VCC  (via drill 0.25 pad 0.13)
  Top 0.178: 41.63,2.32 C5.1 | 38.42,2.35 v38.35,2.29 | C4.1 42.47,22.96 43.23,23.72 45.62,23.72 46.02,23.32 U7.P$5 | 27.98,11.63 R5.2 29.26,11.62 | R6.2 29.26,11.62 | 29.26,11.62 v29.26,6.96 | R13.2 38.28,11.86 38.35,11.94 | C3.1 43.18,14.53 43.84,15.19 45.97,15.19 46.53,14.63 46.53,13.23 U2.1 | v20.68,29.06 20.68,28.78 U8.2 | IC1.5 IC1.6
  Top 0.305: U8.2 21.36,27.34 21.36,23.99 | 21.4,23.98 22.4,23.98 22.81,23.57 22.81,22.4 v23.47,21.74 v23.49,21.72 U3.18 | U3.6 29.78,21.22 arc-90 30.23,20.78 30.23,20.68 | U3.4 29.77,20.22 arc90 30.23,20.68 | 30.23,20.68 v32.92,20.68
  Top 0.406: 21.36,27.34 C6.1 | U10.6 41.63,2.32 | 42.45,22.35 C4.1 38.47,22.34 38.35,22.45 | C3.1 38.35,13.21 | C5.1 38.42,2.35 | v38.35,8.69 38.35,11.94 38.35,13.21 | 38.35,13.21 38.35,20.78 | 38.35,20.78 38.35,22.45 | 21.36,23.99 C15.1 21.4,23.98 | 38.35,22.45 38.35,29.77 | 38.35,29.77 38.35,31.45 39.42,32.51 C8.2 | 38.35,29.77 38.51,29.92 40.64,29.92 41.9,28.67 C2.1 42.79,29.34 IC1.6 | 42.67,32.48 C8.2 | IC1.8 44.14,30.64 43.48,31.29 43.08,31.29 42.62,31.75 42.62,32.5 C8.2 | v41.91,5.89 R2.2 | v32.92,20.68 38.25,20.68 38.35,20.78
  Bottom 0.178: v29.26,6.96 33.88,6.96 35.61,8.69 v38.35,8.69 | v20.68,29.06 16.46,29.06 14.38,31.14 13.16,31.14 12.5,31.8 12.5,32.87 13.87,34.24 13.87,38.2 14.53,38.86 U11.VDD
  Bottom 0.305: v23.49,21.72 23.49,18.06 24.43,17.12 27.43,17.12 28.91,15.65 30.33,15.65 31.55,16.87 31.55,19.51 32.72,20.68 v32.92,20.68
  Bottom 0.406: v41.91,5.89 41.91,4.67 41.15,3.91 38.96,3.91 38.35,4.52 | 38.35,4.52 v38.35,8.69 | v38.35,2.29 38.35,4.52
VNOX
  Top 0.178: 13.87,15.25 13.87,13.46 13.06,12.65 4.98,12.65 4.37,12.04 4.37,10.41 4.88,9.91 7.92,9.91 8.48,9.35 8.48,8.22 MICS4514.B | 13.87,15.25 R16.2 | 13.87,15.25 13.87,16 15.24,17.37 24.17,17.37 24.47,17.67 U3.24
VRED  (via drill 0.25 pad 0.13)
  Top 0.178: v17.07,16.46 21.59,16.46 22.2,15.85 24.64,15.85 25.02,16.23 U3.25 | v5.99,17.17 5.99,15.38 R14.2 6.05,15.33 6.05,14.48 5.59,14.02 4.52,14.02 3.15,12.65 3.15,9.6 5.01,7.74 MICS4514.D
  Bottom 0.178: v17.07,16.46 6.71,16.46 v5.99,17.17
WAKE
  Top 0.178: U10.7 44.78,1.65 44.45,1.32 35.31,1.32 34.59,2.03 34.59,14.83 33.99,15.44 33.99,17.68 32.44,19.22 U3.2

### Text on the board
Bottom: Designed by / Akram Ali / & / Dave Conroy
_tsilk: ISP | MISO | PWR | ANT | SCK | MOSI | RESET | GND | RX | TX | Barometric / Pressure | NC | DTR | MCP1703 / 5V | Temperature / Humidity | Status / LED | Light | I2C Pullups | crtlabs.org | Sensor / Board | VOC / CO2 | CO / NO2 | v0.8 / October 2016